# Altium schematic sheet sdcard.SchDoc
size A4; SheetNumber: 3; SheetTotal: 7
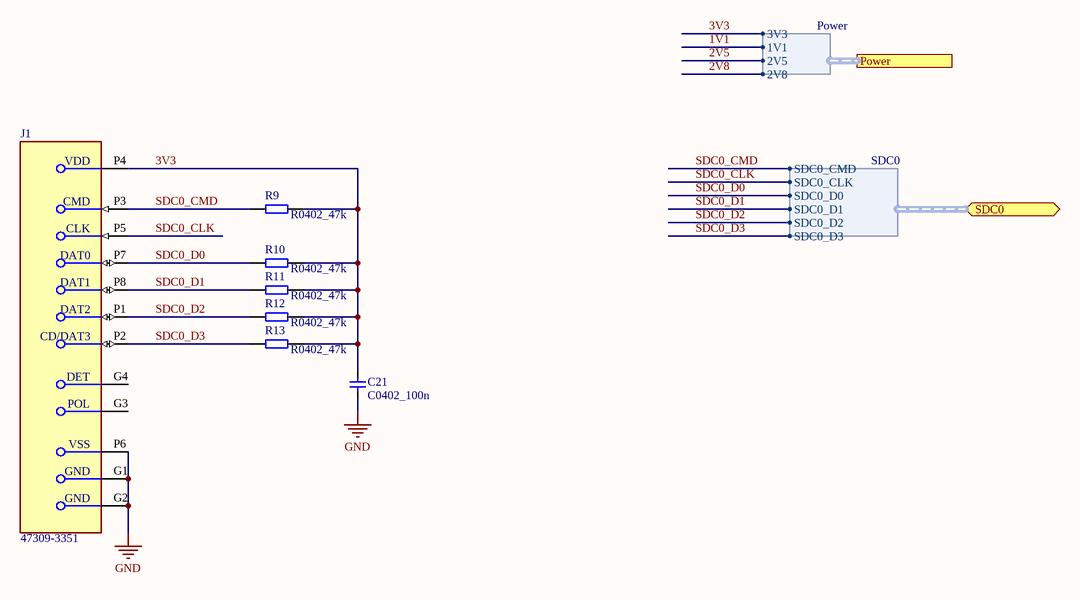
[diagram p0: sdcard.SchDoc]

## Parts
C21  C0402_100n  [C0402]
J1  47309-3351  [FP-47309-3351-MFG]
R9  R0402_47k  [R0402]
R10  R0402_47k  [R0402]
R11  R0402_47k  [R0402]
R12  R0402_47k  [R0402]
R13  R0402_47k  [R0402]

## Ports
Power (harness Power), SDC0 (bidir, harness SDC0)

## Harnesses
SDC0: SDC0_D0, SDC0_D1, SDC0_D2, SDC0_D3, SDC0_CMD, SDC0_CLK
Power: 3V3, 1V1, 2V5, 2V8

## Nets
GND: C21.2 J1.G1(GND) J1.G2(GND) J1.P6(VSS)
1V1: port Power.1V1
2V5: port Power.2V5
2V8: port Power.2V8
3V3: C21.1 J1.P4(VDD) R9.2 R10.2 R11.2 R12.2 R13.2 ; port Power.3V3
SDC0_CLK: J1.P5(CLK) ; port SDC0.SDC0_CLK
SDC0_CMD: J1.P3(CMD) R9.1 ; port SDC0.SDC0_CMD
SDC0_D0: J1.P7(DAT0) R10.1 ; port SDC0.SDC0_D0
SDC0_D1: J1.P8(DAT1) R11.1 ; port SDC0.SDC0_D1
SDC0_D2: J1.P1(DAT2) R12.1 ; port SDC0.SDC0_D2
SDC0_D3: J1.P2(CD/DAT3) R13.1 ; port SDC0.SDC0_D3

Not connected (* = marked no-connect by the designer): J1 G3(POL) G4(DET)

## Library data of the parts
C21 = CMP-003-0006-1: Manufacturer 1: Kemet; Manufacturer Part Number 1: C0402C104K4RACTU; Dielectric: X7R; Voltage Rating DC: 16V; Value: 100n; Tolerance: 0.1%; Part Number: C0402_100n; Pin Count: 2; Component Type: Standard
J1 = CMP-011-000000-2: CONN MICRO SD CARD PUSH-PULL R/A; Current Rating: 500mA; Number of Circuits: 8; Connector Type: Socket; Insulation Resistance: 100MR; Voltage Rating (DC): 5V; Pitch: 1.1mm; Gender: Female; Max Operating Temperature: 85°C; RoHS Compliant: Yes; Source: sdcard.SchLib; Depth: 3.35mm; Number of Contacts: 8; Mount: Surface Mount; Length: 11.4mm; Design Item ID: CMP-04763-000007-1; Width: 5.5mm; Min Operating Temperature: -40°C; Housing Material: Thermoplastic; Contact Material: Bronze; Number of Rows: 1; Termination: SMD/SMT; Series: 47309; Orientation: Right Angle; Contact Plating: Gold; Halogen Free: Low Halogen; Radiation Hardening: No; Package Quantity: 4200; Packaging: Tape and Reel
R9-R13 = CMP-004-0459-1: Manufacturer Part Number 1: CRCW040247K0FKED; Manufacturer 1: Vishay; Power Rating: 62,5mW; Tolerance: 1%; Value: 47k; Part Number: R0402_47k; Component Type: Standard; Pin Count: 2